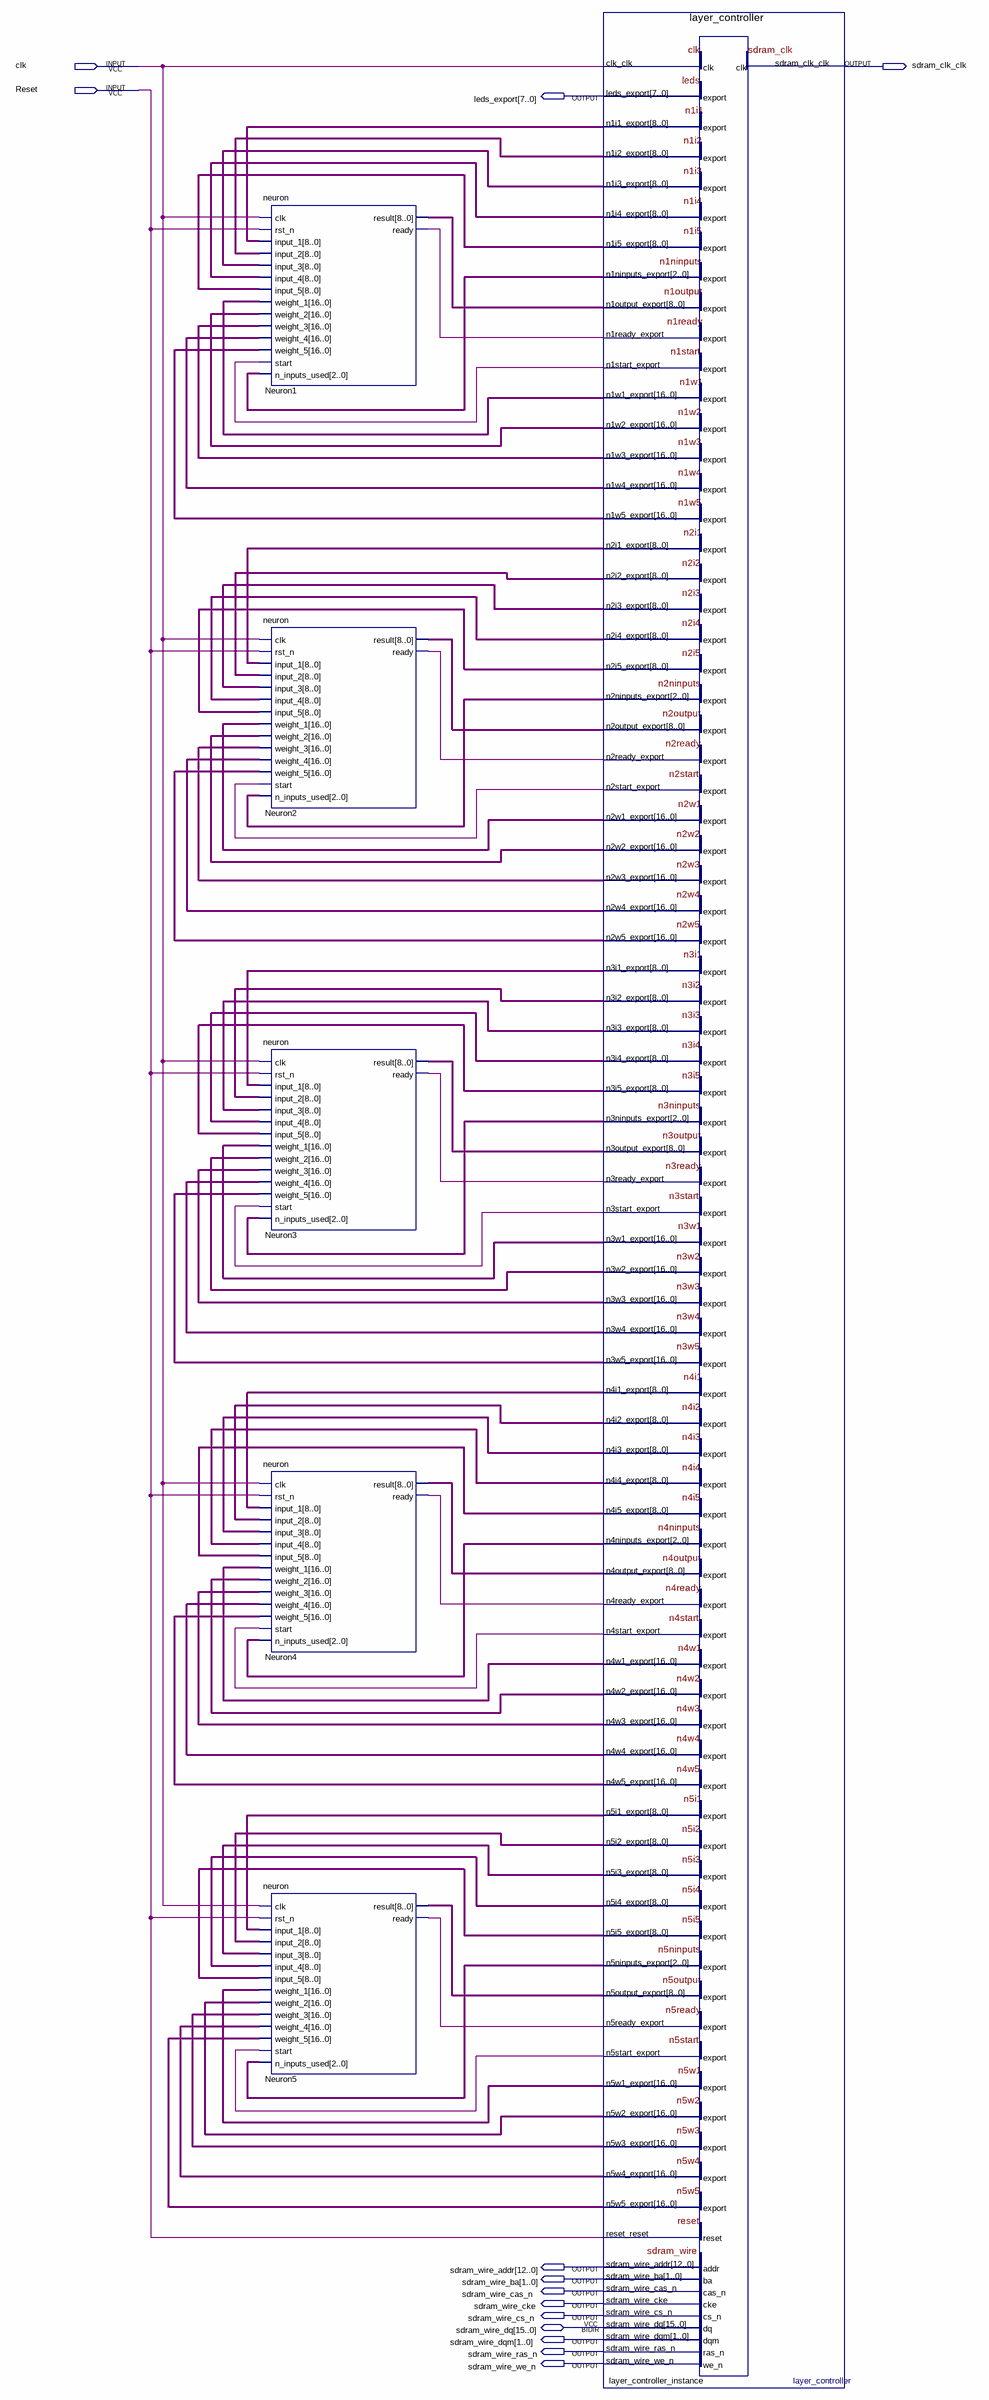
[diagram p0: schematic sheet]
// Quartus schematic network.bdf as structural Verilog: 6 symbols, 13 pins
module network (
  input  clk,
  input  Reset,
  inout  [15:0] sdram_wire_dq,
  output sdram_clk_clk,
  output [7:0] leds_export,
  output [12:0] sdram_wire_addr,
  output [1:0] sdram_wire_ba,
  output sdram_wire_cas_n,
  output sdram_wire_cke,
  output sdram_wire_cs_n,
  output [1:0] sdram_wire_dqm,
  output sdram_wire_ras_n,
  output sdram_wire_we_n
);

  wire layer_controller_instance_n1start_export, layer_controller_instance_n2start_export,
       layer_controller_instance_n3start_export, layer_controller_instance_n4start_export,
       layer_controller_instance_n5start_export, Neuron1_ready, Neuron2_ready, Neuron3_ready, Neuron4_ready,
       Neuron5_ready;
  wire [2:0] layer_controller_instance_n1ninputs_export, layer_controller_instance_n2ninputs_export,
       layer_controller_instance_n3ninputs_export, layer_controller_instance_n4ninputs_export,
       layer_controller_instance_n5ninputs_export;
  wire [8:0] layer_controller_instance_n1i1_export, layer_controller_instance_n1i2_export,
       layer_controller_instance_n1i3_export, layer_controller_instance_n1i4_export,
       layer_controller_instance_n1i5_export, layer_controller_instance_n2i1_export,
       layer_controller_instance_n2i2_export, layer_controller_instance_n2i3_export,
       layer_controller_instance_n2i4_export, layer_controller_instance_n2i5_export,
       layer_controller_instance_n3i1_export, layer_controller_instance_n3i2_export,
       layer_controller_instance_n3i3_export, layer_controller_instance_n3i4_export,
       layer_controller_instance_n3i5_export, layer_controller_instance_n4i1_export,
       layer_controller_instance_n4i2_export, layer_controller_instance_n4i3_export,
       layer_controller_instance_n4i4_export, layer_controller_instance_n4i5_export,
       layer_controller_instance_n5i1_export, layer_controller_instance_n5i2_export,
       layer_controller_instance_n5i3_export, layer_controller_instance_n5i4_export,
       layer_controller_instance_n5i5_export, Neuron1_result, Neuron2_result, Neuron3_result, Neuron4_result,
       Neuron5_result;
  wire [16:0] layer_controller_instance_n1w1_export, layer_controller_instance_n1w2_export,
       layer_controller_instance_n1w3_export, layer_controller_instance_n1w4_export,
       layer_controller_instance_n1w5_export, layer_controller_instance_n2w1_export,
       layer_controller_instance_n2w2_export, layer_controller_instance_n2w3_export,
       layer_controller_instance_n2w4_export, layer_controller_instance_n2w5_export,
       layer_controller_instance_n3w1_export, layer_controller_instance_n3w2_export,
       layer_controller_instance_n3w3_export, layer_controller_instance_n3w4_export,
       layer_controller_instance_n3w5_export, layer_controller_instance_n4w1_export,
       layer_controller_instance_n4w2_export, layer_controller_instance_n4w3_export,
       layer_controller_instance_n4w4_export, layer_controller_instance_n4w5_export,
       layer_controller_instance_n5w1_export, layer_controller_instance_n5w2_export,
       layer_controller_instance_n5w3_export, layer_controller_instance_n5w4_export,
       layer_controller_instance_n5w5_export;

  neuron Neuron1 (
    .clk(clk), .rst_n(Reset), .input_1(layer_controller_instance_n1i1_export),
    .input_2(layer_controller_instance_n1i2_export), .input_3(layer_controller_instance_n1i3_export),
    .input_4(layer_controller_instance_n1i4_export), .input_5(layer_controller_instance_n1i5_export),
    .weight_1(layer_controller_instance_n1w1_export), .weight_2(layer_controller_instance_n1w2_export),
    .weight_3(layer_controller_instance_n1w3_export), .weight_4(layer_controller_instance_n1w4_export),
    .weight_5(layer_controller_instance_n1w5_export), .start(layer_controller_instance_n1start_export),
    .n_inputs_used(layer_controller_instance_n1ninputs_export), .result(Neuron1_result), .ready(Neuron1_ready));
  neuron Neuron2 (
    .clk(clk), .rst_n(Reset), .input_1(layer_controller_instance_n2i1_export),
    .input_2(layer_controller_instance_n2i2_export), .input_3(layer_controller_instance_n2i3_export),
    .input_4(layer_controller_instance_n2i4_export), .input_5(layer_controller_instance_n2i5_export),
    .weight_1(layer_controller_instance_n2w1_export), .weight_2(layer_controller_instance_n2w2_export),
    .weight_3(layer_controller_instance_n2w3_export), .weight_4(layer_controller_instance_n2w4_export),
    .weight_5(layer_controller_instance_n2w5_export), .start(layer_controller_instance_n2start_export),
    .n_inputs_used(layer_controller_instance_n2ninputs_export), .result(Neuron2_result), .ready(Neuron2_ready));
  neuron Neuron3 (
    .clk(clk), .rst_n(Reset), .input_1(layer_controller_instance_n3i1_export),
    .input_2(layer_controller_instance_n3i2_export), .input_3(layer_controller_instance_n3i3_export),
    .input_4(layer_controller_instance_n3i4_export), .input_5(layer_controller_instance_n3i5_export),
    .weight_1(layer_controller_instance_n3w1_export), .weight_2(layer_controller_instance_n3w2_export),
    .weight_3(layer_controller_instance_n3w3_export), .weight_4(layer_controller_instance_n3w4_export),
    .weight_5(layer_controller_instance_n3w5_export), .start(layer_controller_instance_n3start_export),
    .n_inputs_used(layer_controller_instance_n3ninputs_export), .result(Neuron3_result), .ready(Neuron3_ready));
  neuron Neuron4 (
    .clk(clk), .rst_n(Reset), .input_1(layer_controller_instance_n4i1_export),
    .input_2(layer_controller_instance_n4i2_export), .input_3(layer_controller_instance_n4i3_export),
    .input_4(layer_controller_instance_n4i4_export), .input_5(layer_controller_instance_n4i5_export),
    .weight_1(layer_controller_instance_n4w1_export), .weight_2(layer_controller_instance_n4w2_export),
    .weight_3(layer_controller_instance_n4w3_export), .weight_4(layer_controller_instance_n4w4_export),
    .weight_5(layer_controller_instance_n4w5_export), .start(layer_controller_instance_n4start_export),
    .n_inputs_used(layer_controller_instance_n4ninputs_export), .result(Neuron4_result), .ready(Neuron4_ready));
  neuron Neuron5 (
    .clk(clk), .rst_n(Reset), .input_1(layer_controller_instance_n5i1_export),
    .input_2(layer_controller_instance_n5i2_export), .input_3(layer_controller_instance_n5i3_export),
    .input_4(layer_controller_instance_n5i4_export), .input_5(layer_controller_instance_n5i5_export),
    .weight_1(layer_controller_instance_n5w1_export), .weight_2(layer_controller_instance_n5w2_export),
    .weight_3(layer_controller_instance_n5w3_export), .weight_4(layer_controller_instance_n5w4_export),
    .weight_5(layer_controller_instance_n5w5_export), .start(layer_controller_instance_n5start_export),
    .n_inputs_used(layer_controller_instance_n5ninputs_export), .result(Neuron5_result), .ready(Neuron5_ready));
  layer_controller layer_controller_instance (
    .clk_clk(clk), .n1output_export(Neuron1_result), .n1ready_export(Neuron1_ready),
    .n2output_export(Neuron2_result), .n2ready_export(Neuron2_ready), .n3output_export(Neuron3_result),
    .n3ready_export(Neuron3_ready), .n4output_export(Neuron4_result), .n4ready_export(Neuron4_ready),
    .n5output_export(Neuron5_result), .n5ready_export(Neuron5_ready), .reset_reset(Reset),
    .leds_export(leds_export), .n1i1_export(layer_controller_instance_n1i1_export),
    .n1i2_export(layer_controller_instance_n1i2_export), .n1i3_export(layer_controller_instance_n1i3_export),
    .n1i4_export(layer_controller_instance_n1i4_export), .n1i5_export(layer_controller_instance_n1i5_export),
    .n1ninputs_export(layer_controller_instance_n1ninputs_export),
    .n1start_export(layer_controller_instance_n1start_export),
    .n1w1_export(layer_controller_instance_n1w1_export), .n1w2_export(layer_controller_instance_n1w2_export),
    .n1w3_export(layer_controller_instance_n1w3_export), .n1w4_export(layer_controller_instance_n1w4_export),
    .n1w5_export(layer_controller_instance_n1w5_export), .n2i1_export(layer_controller_instance_n2i1_export),
    .n2i2_export(layer_controller_instance_n2i2_export), .n2i3_export(layer_controller_instance_n2i3_export),
    .n2i4_export(layer_controller_instance_n2i4_export), .n2i5_export(layer_controller_instance_n2i5_export),
    .n2ninputs_export(layer_controller_instance_n2ninputs_export),
    .n2start_export(layer_controller_instance_n2start_export),
    .n2w1_export(layer_controller_instance_n2w1_export), .n2w2_export(layer_controller_instance_n2w2_export),
    .n2w3_export(layer_controller_instance_n2w3_export), .n2w4_export(layer_controller_instance_n2w4_export),
    .n2w5_export(layer_controller_instance_n2w5_export), .n3i1_export(layer_controller_instance_n3i1_export),
    .n3i2_export(layer_controller_instance_n3i2_export), .n3i3_export(layer_controller_instance_n3i3_export),
    .n3i4_export(layer_controller_instance_n3i4_export), .n3i5_export(layer_controller_instance_n3i5_export),
    .n3ninputs_export(layer_controller_instance_n3ninputs_export),
    .n3start_export(layer_controller_instance_n3start_export),
    .n3w1_export(layer_controller_instance_n3w1_export), .n3w2_export(layer_controller_instance_n3w2_export),
    .n3w3_export(layer_controller_instance_n3w3_export), .n3w4_export(layer_controller_instance_n3w4_export),
    .n3w5_export(layer_controller_instance_n3w5_export), .n4i1_export(layer_controller_instance_n4i1_export),
    .n4i2_export(layer_controller_instance_n4i2_export), .n4i3_export(layer_controller_instance_n4i3_export),
    .n4i4_export(layer_controller_instance_n4i4_export), .n4i5_export(layer_controller_instance_n4i5_export),
    .n4ninputs_export(layer_controller_instance_n4ninputs_export),
    .n4start_export(layer_controller_instance_n4start_export),
    .n4w1_export(layer_controller_instance_n4w1_export), .n4w2_export(layer_controller_instance_n4w2_export),
    .n4w3_export(layer_controller_instance_n4w3_export), .n4w4_export(layer_controller_instance_n4w4_export),
    .n4w5_export(layer_controller_instance_n4w5_export), .n5i1_export(layer_controller_instance_n5i1_export),
    .n5i2_export(layer_controller_instance_n5i2_export), .n5i3_export(layer_controller_instance_n5i3_export),
    .n5i4_export(layer_controller_instance_n5i4_export), .n5i5_export(layer_controller_instance_n5i5_export),
    .n5ninputs_export(layer_controller_instance_n5ninputs_export),
    .n5start_export(layer_controller_instance_n5start_export),
    .n5w1_export(layer_controller_instance_n5w1_export), .n5w2_export(layer_controller_instance_n5w2_export),
    .n5w3_export(layer_controller_instance_n5w3_export), .n5w4_export(layer_controller_instance_n5w4_export),
    .n5w5_export(layer_controller_instance_n5w5_export), .sdram_clk_clk(sdram_clk_clk),
    .sdram_wire_addr(sdram_wire_addr), .sdram_wire_ba(sdram_wire_ba), .sdram_wire_cas_n(sdram_wire_cas_n),
    .sdram_wire_cke(sdram_wire_cke), .sdram_wire_cs_n(sdram_wire_cs_n), .sdram_wire_dqm(sdram_wire_dqm),
    .sdram_wire_ras_n(sdram_wire_ras_n), .sdram_wire_we_n(sdram_wire_we_n), .sdram_wire_dq(sdram_wire_dq));
endmodule
